# Altium schematic sheet VG_CONN.SchDoc: External Connector
size A4; Date: 2016-06-28; Author: Vitali Tsiukala; DrawnBy: Vitali Tsiukala; Engineer: Vitali Tsiukala; Organization: Trenz Electronic GmbH; DocumentNumber: TE0706; Revision: 02; SheetNumber: 3; SheetTotal: 10
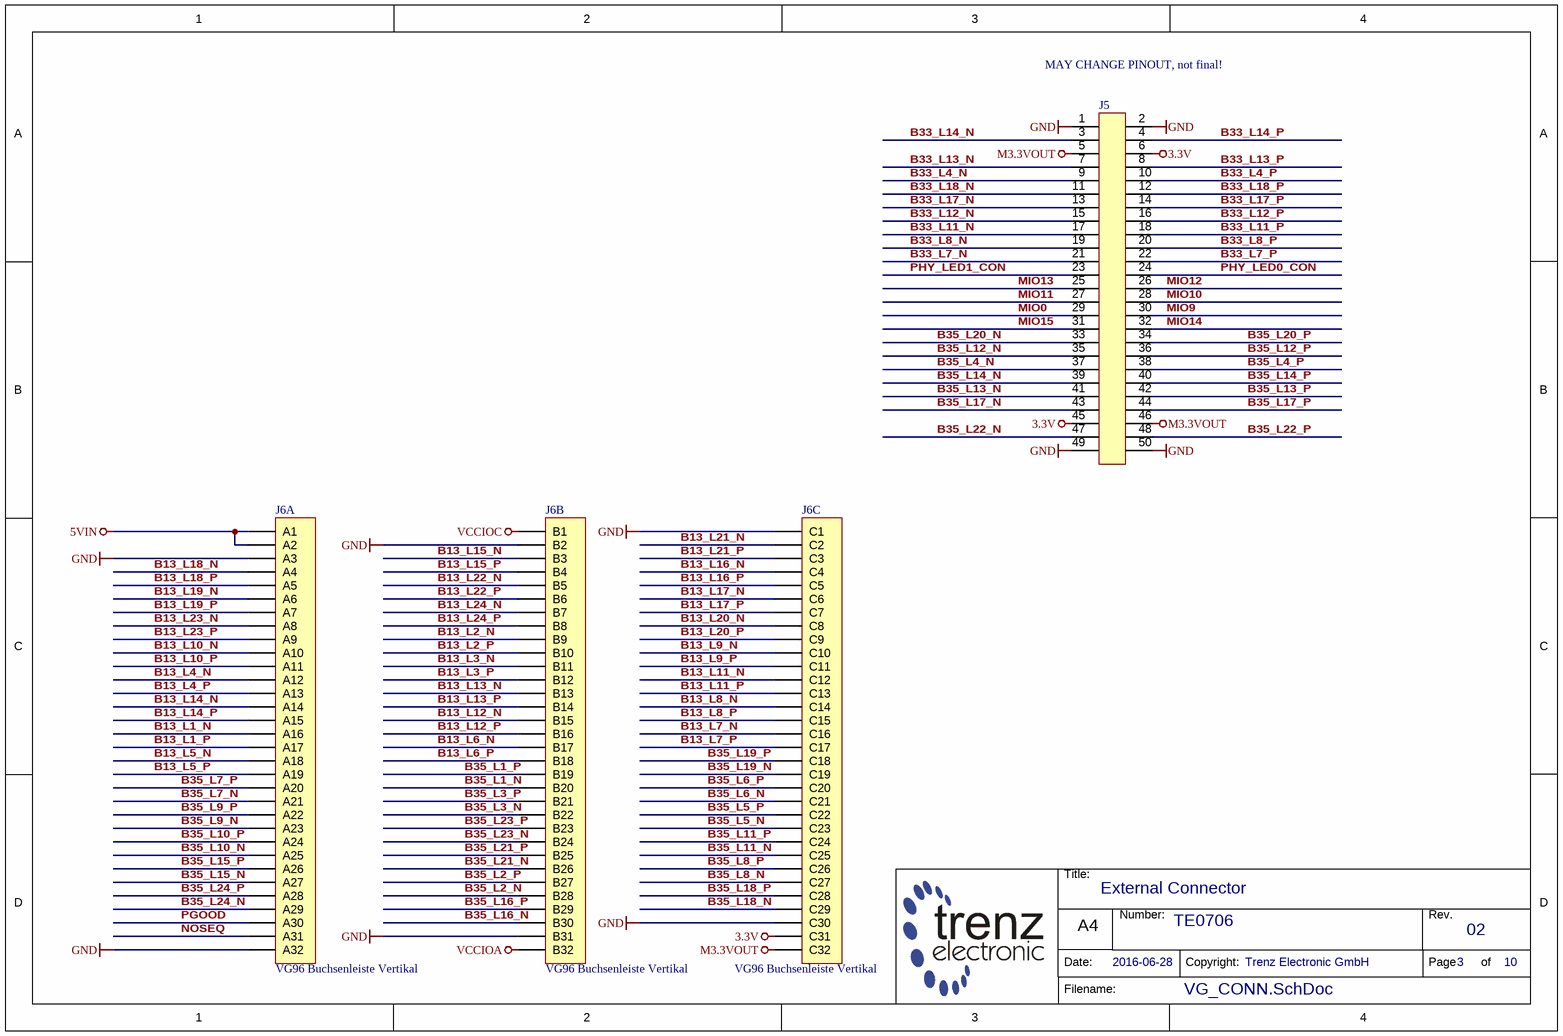
[diagram p0: VG_CONN.SchDoc]

## Parts
J5  WANNE2,54-50 GERADE  [WANNE2,54-50 GERADE]  (value not drawn)
J6  VG96 Buchsenleiste Vertikal  [VG96-F-V]  (parts A,B,C of 3)

## Nets
3.3V: J5.6 J5.45 J6.C31
5VIN: J6.A1 J6.A2
GND: J5.1 J5.2 J5.49 J5.50 J6.A3 J6.A32 J6.B2 J6.B31 J6.C1 J6.C30
M3.3VOUT: J5.5 J5.46 J6.C32
VCCIOA: J6.B32
VCCIOC: J6.B1
B13_L1_N: J6.A16
B13_L1_P: J6.A17
B13_L2_N: J6.B9
B13_L2_P: J6.B10
B13_L3_N: J6.B11
B13_L3_P: J6.B12
B13_L4_N: J6.A12
B13_L4_P: J6.A13
B13_L5_N: J6.A18
B13_L5_P: J6.A19
B13_L6_N: J6.B17
B13_L6_P: J6.B18
B13_L7_N: J6.C16
B13_L7_P: J6.C17
B13_L8_N: J6.C14
B13_L8_P: J6.C15
B13_L9_N: J6.C10
B13_L9_P: J6.C11
B13_L10_N: J6.A10
B13_L10_P: J6.A11
B13_L11_N: J6.C12
B13_L11_P: J6.C13
B13_L12_N: J6.B15
B13_L12_P: J6.B16
B13_L13_N: J6.B13
B13_L13_P: J6.B14
B13_L14_N: J6.A14
B13_L14_P: J6.A15
B13_L15_N: J6.B3
B13_L15_P: J6.B4
B13_L16_N: J6.C4
B13_L16_P: J6.C5
B13_L17_N: J6.C6
B13_L17_P: J6.C7
B13_L18_N: J6.A4
B13_L18_P: J6.A5
B13_L19_N: J6.A6
B13_L19_P: J6.A7
B13_L20_N: J6.C8
B13_L20_P: J6.C9
B13_L21_N: J6.C2
B13_L21_P: J6.C3
B13_L22_N: J6.B5
B13_L22_P: J6.B6
B13_L23_N: J6.A8
B13_L23_P: J6.A9
B13_L24_N: J6.B7
B13_L24_P: J6.B8
B33_L4_N: J5.9
B33_L4_P: J5.10
B33_L7_N: J5.21
B33_L7_P: J5.22
B33_L8_N: J5.19
B33_L8_P: J5.20
B33_L11_N: J5.17
B33_L11_P: J5.18
B33_L12_N: J5.15
B33_L12_P: J5.16
B33_L13_N: J5.7
B33_L13_P: J5.8
B33_L14_N: J5.3
B33_L14_P: J5.4
B33_L17_N: J5.13
B33_L17_P: J5.14
B33_L18_N: J5.11
B33_L18_P: J5.12
B35_L1_N: J6.B20
B35_L1_P: J6.B19
B35_L2_N: J6.B28
B35_L2_P: J6.B27
B35_L3_N: J6.B22
B35_L3_P: J6.B21
B35_L4_N: J5.37
B35_L4_P: J5.38
B35_L5_N: J6.C23
B35_L5_P: J6.C22
B35_L6_N: J6.C21
B35_L6_P: J6.C20
B35_L7_N: J6.A21
B35_L7_P: J6.A20
B35_L8_N: J6.C27
B35_L8_P: J6.C26
B35_L9_N: J6.A23
B35_L9_P: J6.A22
B35_L10_N: J6.A25
B35_L10_P: J6.A24
B35_L11_N: J6.C25
B35_L11_P: J6.C24
B35_L12_N: J5.35
B35_L12_P: J5.36
B35_L13_N: J5.41
B35_L13_P: J5.42
B35_L14_N: J5.39
B35_L14_P: J5.40
B35_L15_N: J6.A27
B35_L15_P: J6.A26
B35_L16_N: J6.B30
B35_L16_P: J6.B29
B35_L17_N: J5.43
B35_L17_P: J5.44
B35_L18_N: J6.C29
B35_L18_P: J6.C28
B35_L19_N: J6.C19
B35_L19_P: J6.C18
B35_L20_N: J5.33
B35_L20_P: J5.34
B35_L21_N: J6.B26
B35_L21_P: J6.B25
B35_L22_N: J5.47
B35_L22_P: J5.48
B35_L23_N: J6.B24
B35_L23_P: J6.B23
B35_L24_N: J6.A29
B35_L24_P: J6.A28
MIO0: J5.29
MIO9: J5.30
MIO10: J5.28
MIO11: J5.27
MIO12: J5.26
MIO13: J5.25
MIO14: J5.32
MIO15: J5.31
NOSEQ: J6.A31
PGOOD: J6.A30
PHY_LED0_CON: J5.24
PHY_LED1_CON: J5.23

## Notes on the sheet
- MAY CHANGE PINOUT, not final!
- Title:
- Number:
- Rev.
- Date:
- A4
- Copyright:
- Page
- of
- Filename:

## Library data of the parts
J5 = 20131: Stiftleiste Wanne 50polig; AN: 20131; Mixed: THT; Trenz-Stock: Yes; HelpURL: B:\AD\adlib\datasheet\137
J6 = 21545: VG96 Buchsenleiste Vertikal (DIN 41612); AN: 21545; Trenz-Stock: Yes; Mixed: THT; HelpURL: B:\AD\adlib\datasheet\VG96